# EAGLE schematic EEPROM Programmer (EAGLE 9.4.2)
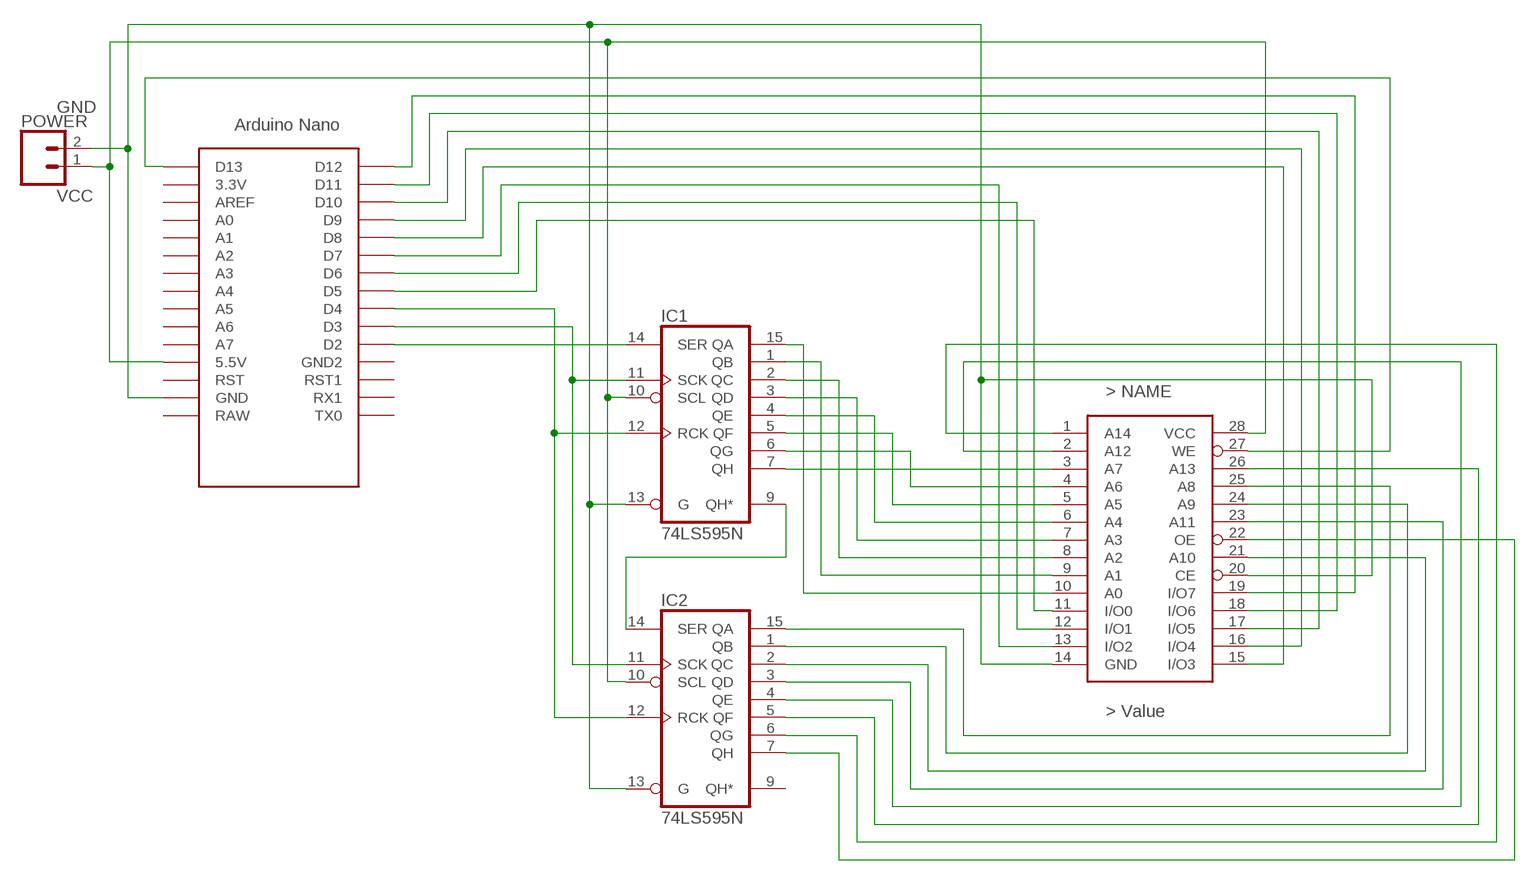
[diagram p0: schematic, sheet 1]

## Parts
EEPROM  28C256  [DIP1722W26P254L3450H508Q28B]
IC1  74LS595N  [DIL16]
IC2  74LS595N  [DIL16]
POWER  CONN_02POGO_PIN_HOLES_ONLY  [1X02_PP_HOLES_ONLY]
U$1  NANO  [NANO]

## Nets
GND: EEPROM.14(GND) EEPROM.20(CE) IC1.13(G) IC2.13(G) POWER.2 U$1.GND
N$1: EEPROM.27(WE) U$1.D13
N$2: IC1.14(SER) U$1.D2
N$3: IC1.11(SCK) IC2.11(SCK) U$1.D3
N$4: IC1.12(RCK) IC2.12(RCK) U$1.D4
N$5: EEPROM.19(I/O7) U$1.D12
N$6: EEPROM.18(I/O6) U$1.D11
N$7: EEPROM.17(I/O5) U$1.D10
N$8: EEPROM.16(I/O4) U$1.D9
N$9: EEPROM.15(I/O3) U$1.D8
N$11: EEPROM.13(I/O2) U$1.D7
N$12: IC1.9(QH*) IC2.14(SER)
N$13: EEPROM.12(I/O1) U$1.D6
N$14: EEPROM.10(A0) IC1.15(QA)
N$15: EEPROM.9(A1) IC1.1(QB)
N$16: EEPROM.8(A2) IC1.2(QC)
N$17: EEPROM.7(A3) IC1.3(QD)
N$18: EEPROM.6(A4) IC1.4(QE)
N$20: EEPROM.5(A5) IC1.5(QF)
N$21: EEPROM.11(I/O0) U$1.D5
N$22: EEPROM.4(A6) IC1.6(QG)
N$23: EEPROM.3(A7) IC1.7(QH)
N$24: EEPROM.24(A9) IC2.1(QB)
N$25: EEPROM.25(A8) IC2.15(QA)
N$26: EEPROM.21(A10) IC2.2(QC)
N$27: EEPROM.23(A11) IC2.3(QD)
N$28: EEPROM.2(A12) IC2.4(QE)
N$29: EEPROM.26(A13) IC2.5(QF)
N$30: EEPROM.1(A14) IC2.6(QG)
N$31: EEPROM.22(OE) IC2.7(QH)
VCC: EEPROM.28(VCC) IC1.10(SCL) IC2.10(SCL) POWER.1 U$1.5V(5.5V)
Unconnected: IC2.9(QH*) U$1.3.3V U$1.A0 U$1.A1 U$1.A2 U$1.A3 U$1.A4 U$1.A5 U$1.A6 U$1.A7 U$1.AREF U$1.GND1(GND2) U$1.ICSP1 U$1.ICSP2 U$1.ICSP3 U$1.ICSP4 U$1.ICSP5 U$1.ICSP6 U$1.RAW U$1.RST U$1.RST1 U$1.RX1 U$1.TX0

## Power pins joined to a net without a drawn wire
GND: IC1.8(GND) IC2.8(GND)
VCC: IC1.16(VCC) IC2.16(VCC)

## Library data of the parts
EEPROM = Computer_Parts:28C256
IC1 IC2 = 74xx-us:74*595: 8-bit SHIFT REGISTER, output latch
POWER = SparkFun-Connectors:CONN_02: Multi connection point. Often used as Generic Header-pin footprint for 0.1 inch spaced/style header connections On any of the 0.1 inch spaced packages, you can populate with these: Break Away Headers - Straight <https://www.sparkfun.com/products/116> (PRT-00116) Break Away Male Headers - Right Angle <https://www.sparkfun.com/products/553> (PRT-00553) Female Headers <https://www.sparkfun.com/products/115> (PRT-00115) Break Away Headers - Machine Pin <https://www.sparkfun.com/products/117> (PRT-00117) Break Away Female Headers - Swiss Machine Pin <https://www.sparkfun.com/products/743> (PRT-00743) For SCREWTERMINALS and SPRING TERMINALS visit here: Screw Terimnals on SparkFun.com <https://www.sparkfun.com/search/results?term=Screw+Terminals> (5mm/3.5mm/2.54mm spacing) This device is also useful as a general connection point to wire up your design to another part of your project. Our various solder wires solder well into these plated through hole pads. Hook-Up Wire - Assortment (Stranded, 22 AWG) <https://www.sparkfun.com/products/11375> (PRT-11375) Hook-Up Wire - Assortment (Solid Core, 22 AWG) <https://www.sparkfun.com/products/11367> (PRT-11367) View the entire wire category on our website here <https://www.sparkfun.com/categories/141> Special notes: Molex polarized connector foot print use with: PRT-08233 with associated crimp pins and housings. 2.54_SCREWTERM for use with PRT-10571. 3.5mm Screw Terminal footprints for PRT-08084 5mm Screw Terminal footprints for use with PRT-08432
U$1 = Arduino-clone:NANO: Arduino Nano